# Altium schematic sheet Block_diagram.SchDoc
size A3; DocumentNumber: 2; SheetNumber: 2; SheetTotal: 4
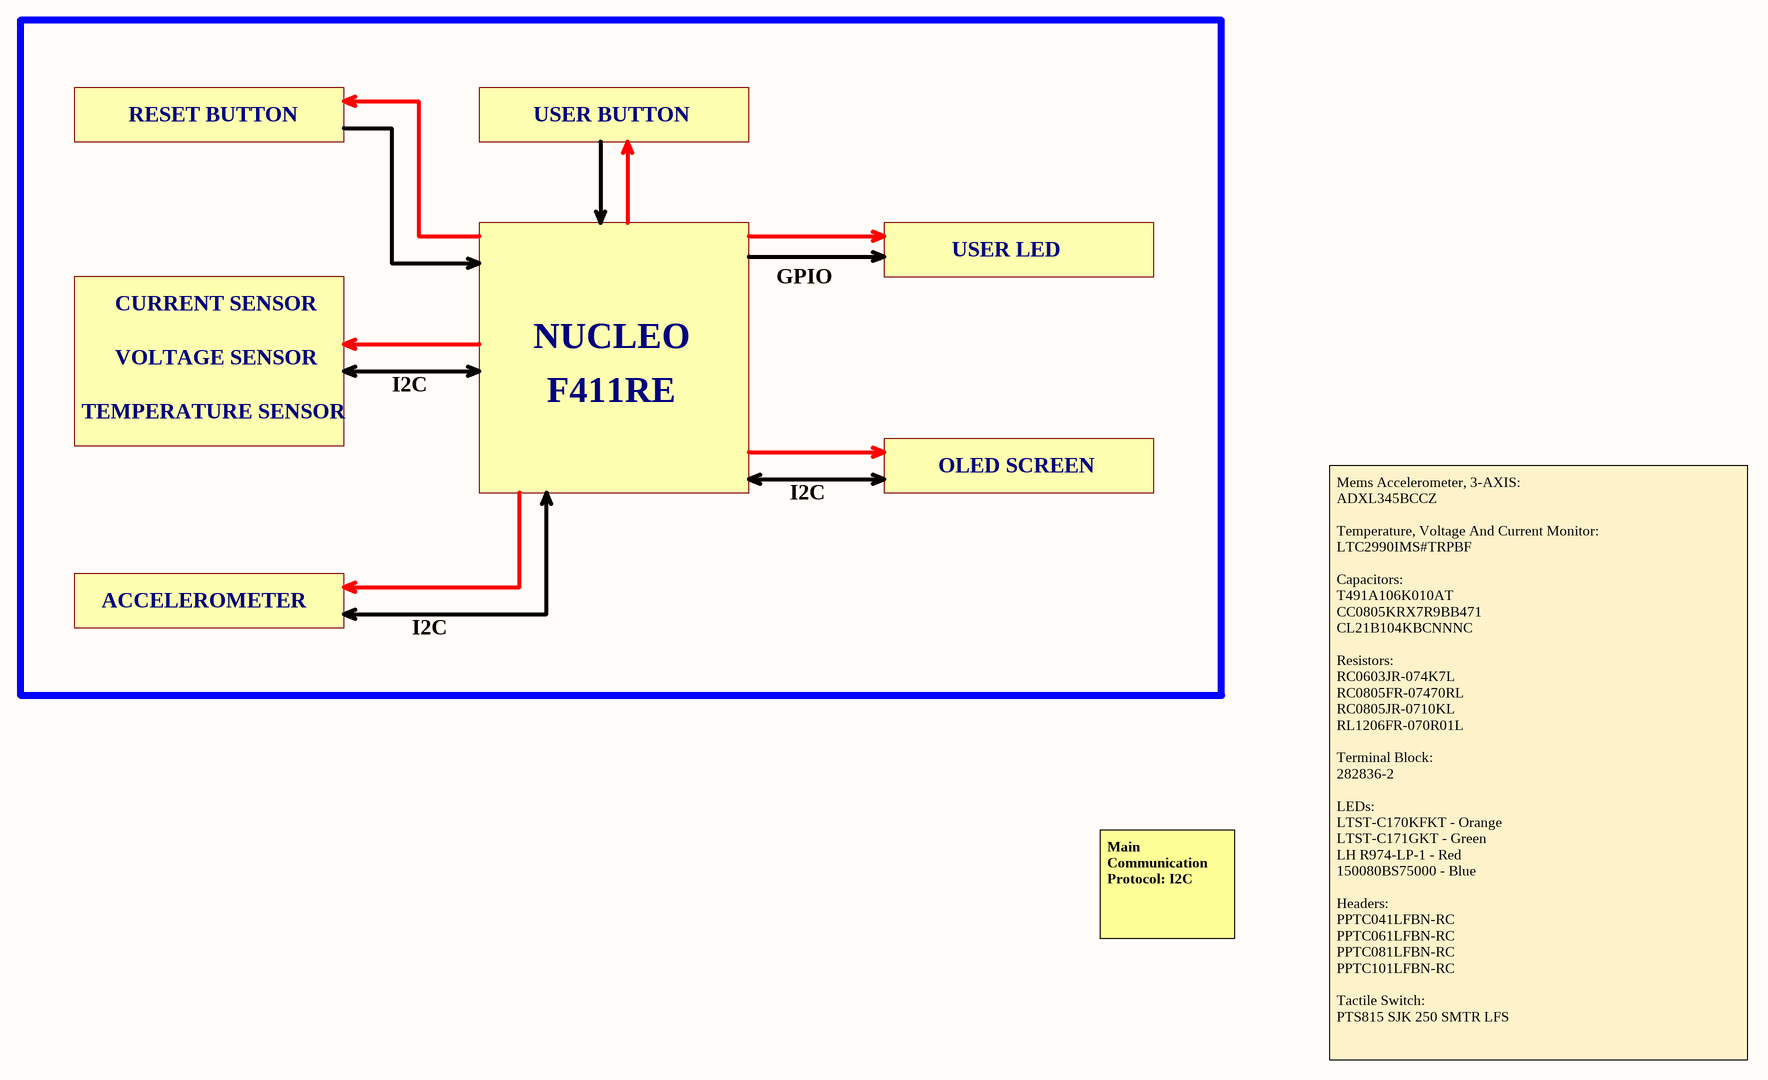
[diagram p0: Block_diagram.SchDoc]

## Notes on the sheet
- RESET BUTTON
- USER BUTTON
- CURRENT SENSOR
- GPIO
- USER LED
- VOLTAGE SENSOR
- NUCLEO
- TEMPERATURE SENSOR
- I2C
- F411RE
- OLED SCREEN
- ACCELEROMETER
- Main Communication Protocol: I2C
- Mems Accelerometer, 3-AXIS:
  ADXL345BCCZ
  Temperature, Voltage And Current Monitor:
  LTC2990IMS#TRPBF
  Capacitors:
  T491A106K010AT
  CC0805KRX7R9BB471
  CL21B104KBCNNNC
  Resistors:
  RC0603JR-074K7L
  RC0805FR-07470RL
  RC0805JR-0710KL
  RL1206FR-070R01L
  Terminal Block:
  282836-2
  LEDs:
  LTST-C170KFKT - Orange
  LTST-C171GKT - Green
  LH R974-LP-1 - Red
  150080BS75000 - Blue
  Headers:
  PPTC041LFBN-RC
  PPTC061LFBN-RC
  PPTC081LFBN-RC
  PPTC101LFBN-RC
  Tactile Switch:
  PTS815 SJK 250 SMTR LFS
- DOSYA ADI / FILE NAME
- TANIM / DESCRIPTION
- HAZIRLAYAN / PREPARED BY
- YAYIN TARİHİ / REL. DATE
- BOYUT / SIZE
- SAYFA / SHEET
- /